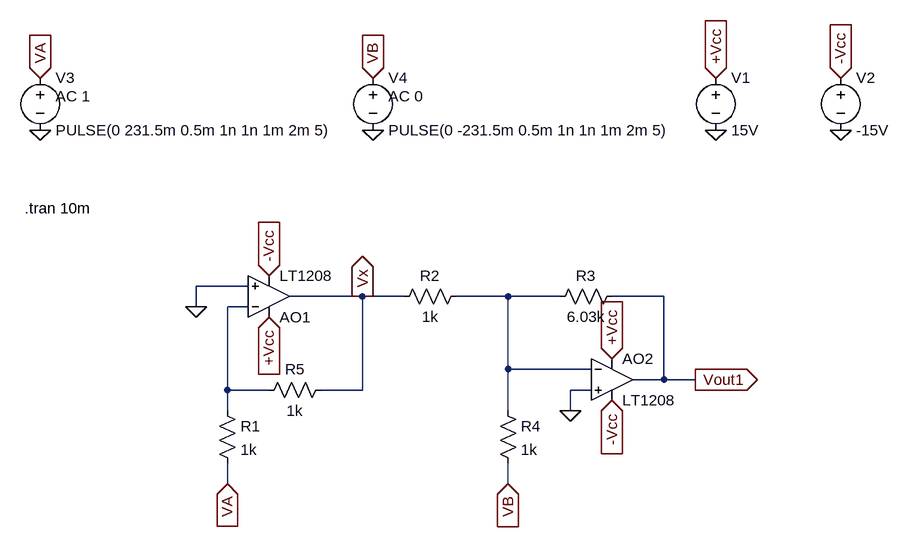
[diagram p0: schematic SR.asc]
SR.asc, the LTspice schematic file:
Version 4.1
SHEET 1 980 680
WIRE -16 16 -96 16
WIRE 160 32 48 32
WIRE 224 32 160 32
WIRE 384 32 304 32
WIRE 464 32 384 32
WIRE 624 32 544 32
WIRE -96 48 -96 16
WIRE -16 48 -48 48
WIRE 384 144 384 32
WIRE 512 144 384 144
WIRE 624 160 624 32
WIRE 624 160 576 160
WIRE 672 160 624 160
WIRE -48 176 -48 48
WIRE 16 176 -48 176
WIRE 160 176 160 32
WIRE 160 176 96 176
WIRE 512 176 480 176
WIRE -48 208 -48 176
WIRE 384 208 384 144
WIRE 480 208 480 176
WIRE -48 320 -48 288
WIRE 384 320 384 288
FLAG -96 48 0
FLAG 480 208 0
FLAG 384 320 VB
IOPIN 384 320 In
FLAG -48 320 VA
IOPIN -48 320 In
FLAG 672 160 Vout1
IOPIN 672 160 Out
FLAG 16 64 +Vcc
IOPIN 16 64 In
FLAG 544 128 +Vcc
IOPIN 544 128 In
FLAG 16 0 -Vcc
IOPIN 16 0 In
FLAG 544 192 -Vcc
IOPIN 544 192 In
FLAG 160 32 Vx
IOPIN 160 32 Out
FLAG -336 -224 0
FLAG 176 -224 0
FLAG -336 -304 VA
IOPIN -336 -304 In
FLAG 176 -304 VB
IOPIN 176 -304 In
FLAG 704 -304 +Vcc
IOPIN 704 -304 In
FLAG 896 -304 -Vcc
IOPIN 896 -304 In
FLAG 704 -224 0
FLAG 896 -224 0
SYMBOL OpAmps\\LT1208 16 96 M180
SYMATTR InstName AO1
SYMBOL res -64 192 R0
SYMATTR InstName R1
SYMATTR Value 1k
SYMBOL res 208 48 R270
WINDOW 0 32 56 VTop 2
WINDOW 3 0 56 VBottom 2
SYMATTR InstName R2
SYMATTR Value 1k
SYMBOL res 448 48 R270
WINDOW 0 32 56 VTop 2
WINDOW 3 0 56 VBottom 2
SYMATTR InstName R3
SYMATTR Value 6.03k
SYMBOL res 368 192 R0
SYMATTR InstName R4
SYMATTR Value 1k
SYMBOL OpAmps\\LT1208 544 96 R0
SYMATTR InstName AO2
SYMBOL res 0 192 R270
WINDOW 0 32 56 VTop 2
WINDOW 3 0 56 VBottom 2
SYMATTR InstName R5
SYMATTR Value 1k
SYMBOL voltage 704 -320 R0
WINDOW 123 24 44 Left 2
WINDOW 39 0 0 Left 0
SYMATTR InstName V1
SYMATTR Value 15V
SYMBOL voltage 896 -320 R0
SYMATTR InstName V2
SYMATTR Value -15V
SYMBOL voltage -336 -320 R0
WINDOW 123 24 44 Left 2
WINDOW 39 0 0 Left 0
SYMATTR Value2 AC 1
SYMATTR InstName V3
SYMATTR Value PULSE(0 231.5m 0.5m 1n 1n 1m 2m 5)
SYMBOL voltage 176 -320 R0
WINDOW 123 24 44 Left 2
WINDOW 39 0 0 Left 0
SYMATTR Value2 AC 0
SYMATTR InstName V4
SYMATTR Value PULSE(0 -231.5m 0.5m 1n 1n 1m 2m 5)
TEXT -360 -104 Left 2 !.tran 10m

The netlist it stands for:
* SR.asc
X§AO1 0 N002 +Vcc -Vcc Vx LT1208  ; pins In+ In- V+ V- OUT
R1 N002 VA 1k
R2 Vx N001 1k
R3 N001 Vout1 6.03k
R4 N001 VB 1k
X§AO2 0 N001 +Vcc -Vcc Vout1 LT1208  ; pins In+ In- V+ V- OUT
R5 N002 Vx 1k
V1 +Vcc 0 15V
V2 -Vcc 0 -15V
V3 VA 0 PULSE(0 231.5m 0.5m 1n 1n 1m 2m 5) AC 1
V4 VB 0 PULSE(0 -231.5m 0.5m 1n 1n 1m 2m 5) AC 0
.tran 10m
.backanno
.end